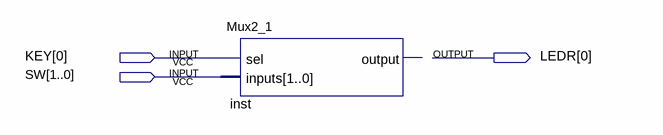
[diagram p0: schematic sheet]
// Quartus schematic Mux2_1Demo.bdf as structural Verilog: 1 symbols, 3 pins
module Mux2_1Demo (
  input  [0:0] KEY,
  input  [1:0] SW,
  output [0:0] LEDR
);

  Mux2_1 inst (.sel(KEY[0]), .inputs(SW));  // open: output
endmodule
